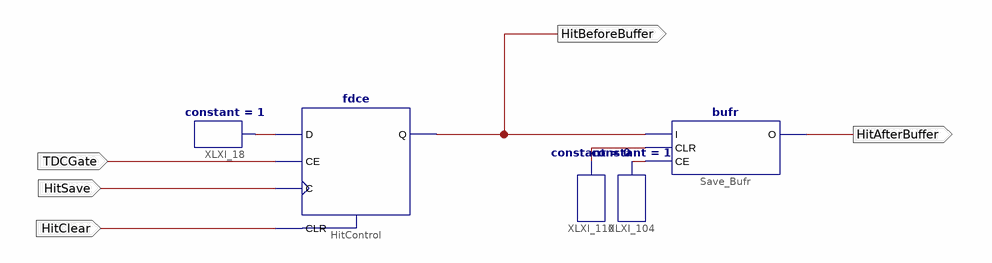
[diagram p0: schematic sheet 1]
// Xilinx ISE schematic TDCHitControl.sch (virtex4) as structural Verilog: 5 symbols, 5 ports
module TDCHitControl (
  input  HitSave,
  input  TDCGate,
  input  HitClear,
  output HitBeforeBuffer,
  output HitAfterBuffer
);

  wire XLXN_84, XLXN_313, XLXN_340;

  fdce #(.RLOC("X0Y0")) HitControl (.C(HitSave), .CE(TDCGate), .CLR(HitClear), .D(XLXN_84), .Q(HitBeforeBuffer));
  constant #(.CValue("1")) XLXI_18 (.O(XLXN_84));
  bufr Save_Bufr (.I(HitBeforeBuffer), .CLR(XLXN_340), .CE(XLXN_313), .O(HitAfterBuffer));
  constant #(.CValue("1")) XLXI_104 (.O(XLXN_313));
  constant #(.CValue("0")) XLXI_110 (.O(XLXN_340));
endmodule
